# EasyEDA schematic BoilerController.json
TITLE: BoilerController; REV: 1.2; Date: 2022-11-02; Sheet: 1/1; Drawn By: Marc Engrie; Company: Service ME
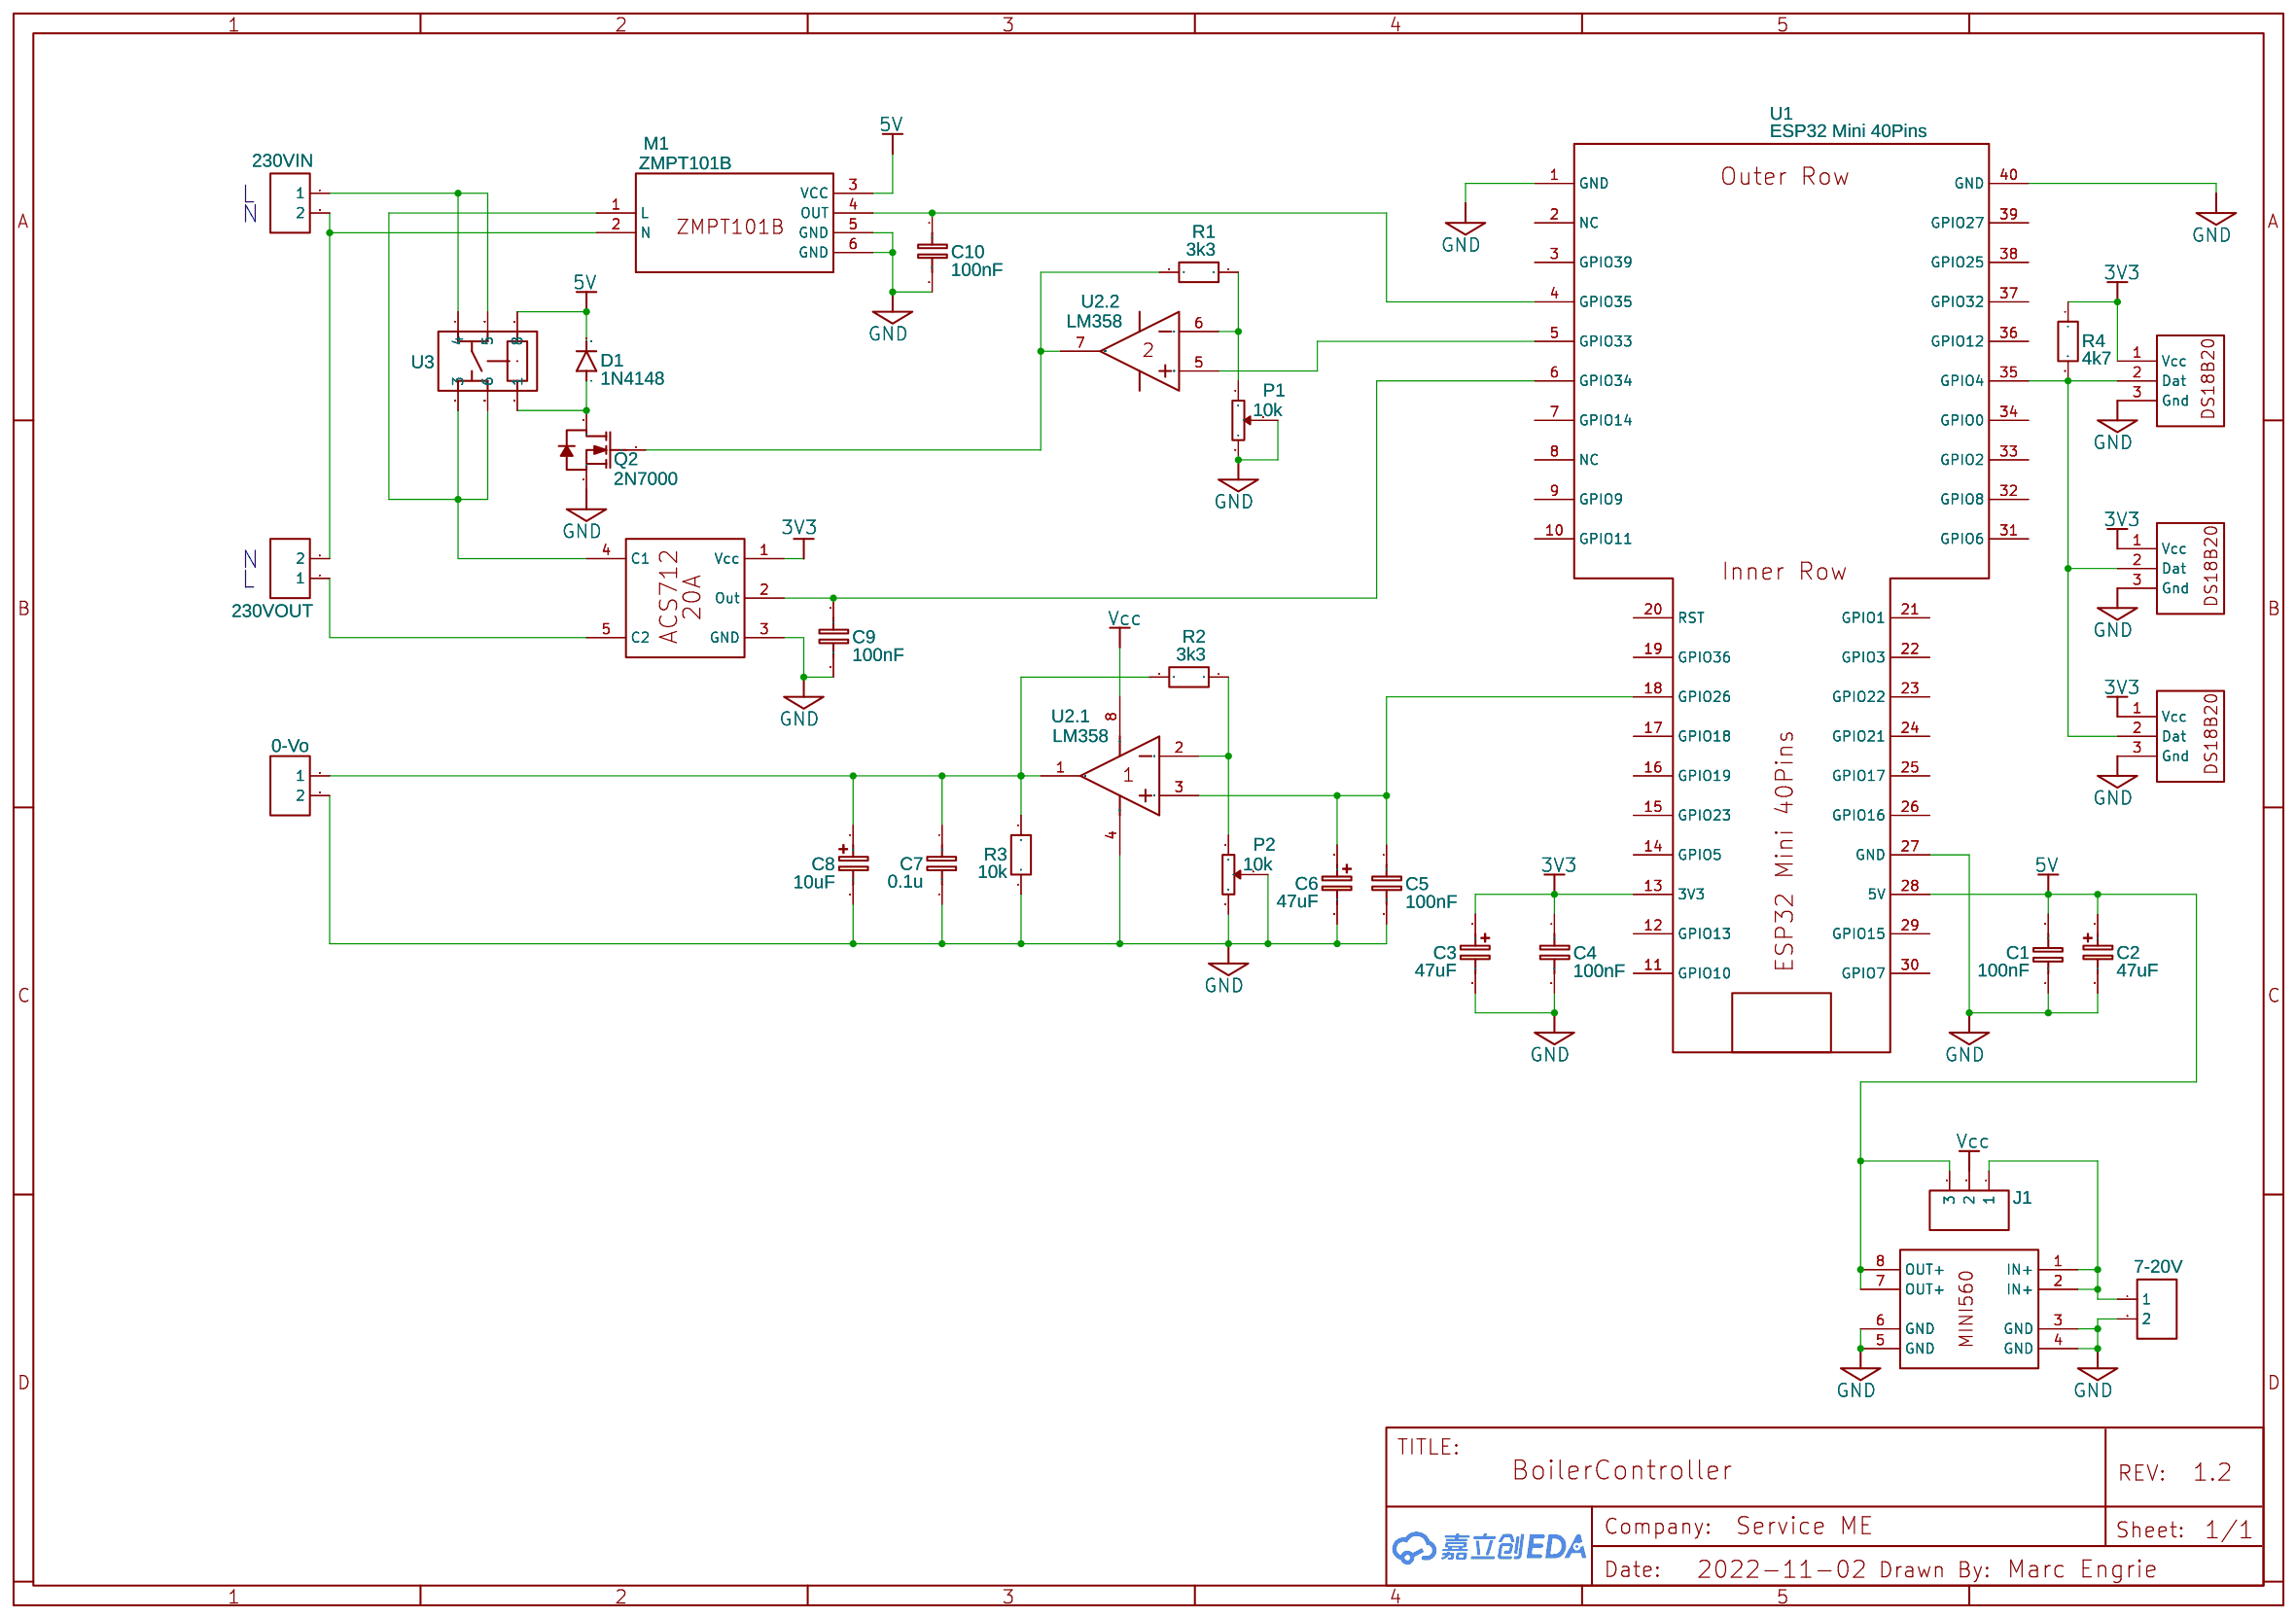
[diagram p0: schematic sheet]

## Parts
C1  100nF  [RAD-0.1]
C2  47uF  [CAP-D6.3×F2.5]
C3  47uF  [CAP-D6.3×F2.5]
C4  100nF  [RAD-0.1]
C5  100nF  [RAD-0.1]
C6  47uF  [CAP-D6.3×F2.5]
C7  0.1u  [RAD-0.1]
C8  10uF  [CAP-D6.3×F2.5]
C9  100nF  [RAD-0.1]
C10  100nF  [RAD-0.1]
D1  1N4148  [DIODE-1N4148]
J1  HDR-M-2.54_1x3  [HDR-M-2.54_1X3]
J2  7-20V  [CONN-TH_2P-P5.08]
J3  230VIN  [CONN-TH_2P-P5.08]
J4  230VOUT  [CONN-TH_2P-P5.08]
J5  0-Vo  [CONN-TH_2P-P5.08]
M1  ZMPT101B  [ZMPT101B-MODULE]
M3  Mini560_DC-DC  [MINI560_DC-DC]
P1  10k  [68W TRIMMER POT]
P2  10k  [68W TRIMMER POT]
Q2  2N7000  [TO-92-3_L4.8-W3.7-P2.54-L]
R1  3k3  [R_AXIAL-0.3]
R2  3k3  [R_AXIAL-0.3]
R3  10k  [R_AXIAL-0.3]
R4  4k7  [R_AXIAL-0.3]
U1  ESP32 Mini 40Pins  [ESP32 MINI 40PINS]
U2  LM358  [DIP-8_L9.8-W6.6-P2.54-LS7.6-BL]  (sections 1,2)
U3  G2RL-1A-E-CV DC12  [G2RL-1A-E-CV]
U7  ACS712-20A  [ACS712-20A]
U8  DS18B20  [DS18B20]
U9  DS18B20  [DS18B20]
U10  DS18B20  [DS18B20]

## Library data of the parts
C1 C4 C5 C7 C9 C10 = C_RAD-0.1_EU: Contributor: LCEDA_Lib
C2 C3 C6 C8 = CE_TH_D6.3×F2.5_EU: Contributor: LCEDA_Lib
D1 = Diode 1N4148S: DO-34_BD1.6-L3.0-P7.00-D0.6-RD; Contributor: RickCord
J1 = HDR-M-2.54_1x3: Supplier Part: C180248; Supplier: LCSC; Contributor: LCEDA_Lib
J2-J5 = CONN-TH_2P-P5.08: Supplier: LCSC; Contributor: LCEDA_Lib; Package Display: No
M1 = ZMPT101B-SHIELD COPY: Manufacturer: sterling; Supplier: LCSC; link: https://lcsc.com/product-detail/Current-Transformers_Qingxian-Zeming-Langxi-Elec-ZMPT101B_C111858.html; Contributor: Bosco_Sterling; Package Display: No
M3 = Mini560_DC-DC: Contributor: mengrie; Package Display: No
P1 P2 = Trimpot: Manufacturer Part: 68W trimmer potentiometer; Contributor: terryjmyers
Q2 = 2N7000TA: Supplier: LCSC; Supplier Part: C107290; Manufacturer: ON Semicon; Contributor: LCSC; JLCPCB Part Class: Extended Part
R1-R4 = R_AXIAL-0.3_EU: Contributor: LCEDA_Lib
U1 = ESP32 Mini 40Pins: Contributor: mengrie
U2 = LM358GN: Supplier: LCSC; Supplier Part: C2902318; Manufacturer: HTC; subpart_no: 2; JLCPCB Part Class: Extended Part
U3 = G2RL-1A-E-CV DC12: Manufacturer: Omron Electronics Inc-EMC Div; Manufacturer Part: RELAY; Supplier: Digi-Key; link: https://www.digikey.ca/en/products/detail/omron-electronics-inc-emc-div/G2RL-1A-E-CV-DC12/2755180; Contributor: Andy Dominique
U7 = ACS712-20A: Supplier: Aliexpress; Contributor: mengrie
U8-U10 = DS18B20: Contributor: mengrie

## Nets
3V3: C3.1 C4.1 R4.1 U1.13(3V3) U7.1(Vcc) U8.1(Vcc) U9.1(Vcc) U10.1(Vcc)
5V: C1.2 C2.1 D1.C J1.3 M1.3(VCC) M3.7(OUT+) M3.8(OUT+) U1.28(5V) U3.8
GND: C1.1 C2.2 C3.2 C4.2 C5.2 C6.2 C7.2 C8.2 C9.2 C10.2 J2.2 J5.2 M1.5(GND) M1.6(GND) M3.3(GND) M3.4(GND) M3.5(GND) M3.6(GND) P1.2 P1.3 P2.2 P2.3 Q2.1(S) R3.2 U1.1(GND) U1.27(GND) U1.40(GND) U2.4(GND) U7.3(GND) U8.3(Gnd) U9.3(Gnd) U10.3(Gnd)
Vcc: J1.2 U2.8(VCC)
Net-(C5-1): C5.1 C6.1 U1.18(GPIO26) U2.3(+IN1)
Net-(C7-1): C7.1 C8.1 J5.1 R2.2 R3.1 U2.1(OUT1)
Net-(C9-1): C9.1 U1.6(GPIO34) U7.2(Out)
Net-(C10-1): C10.1 M1.4(OUT) U1.4(GPIO35)
Net-(D1-A): D1.A Q2.3(D) U3.1
Net-(J1-1): J1.1 J2.1 M3.1(IN+) M3.2(IN+)
Net-(J3-1): J3.1 U3.4 U3.5
Net-(J3-2): J3.2 J4.2 M1.2(N)
Net-(J4-1): J4.1 U7.5(C2)
Net-(M1-1): M1.1(L) U3.3 U3.6 U7.4(C1)
Net-(P1-1): P1.1 R1.1 U2.6(-IN1)
Net-(P2-1): P2.1 R2.1 U2.2(-IN1)
Net-(Q2-2): Q2.2(G) R1.2 U2.7(OUT2)
Net-(R4-2): R4.2 U1.35(GPIO4) U8.2(Dat) U9.2(Dat) U10.2(Dat)
Net-(U1-5): U1.5(GPIO33) U2.5(+IN2)

Not connected (* = marked no-connect by the designer): U1 2(NC) 3(GPIO39) 7(GPIO14) 8(NC) 9(GPIO9) 10(GPIO11) 11(GPIO10) 12(GPIO13) 14(GPIO5) 15(GPIO23) 16(GPIO19) 17(GPIO18) 19(GPIO36) 20(RST) 21(GPIO1) 22(GPIO3) 23(GPIO22) 24(GPIO21) 25(GPIO17) 26(GPIO16) 29(GPIO15) 30(GPIO7) 31(GPIO6) 32(GPIO8) 33(GPIO2) 34(GPIO0) 36(GPIO12) 37(GPIO32) 38(GPIO25) 39(GPIO27)

## Notes on the sheet
- L
- N
- N
- L
